# EAGLE design programmer (EAGLE 7.6.0)
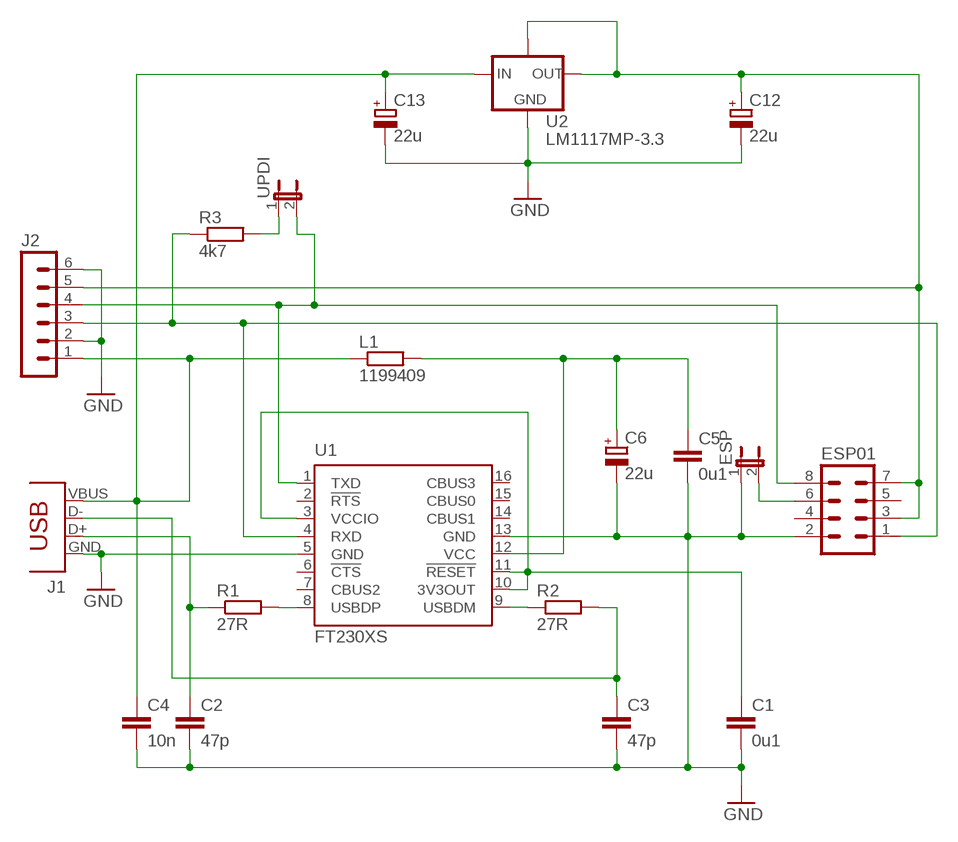
[diagram p0: schematic, sheet 1]

## Parts
C1  0u1  C-EUC0805  [C0805]
C2  47p  C-EUC0805  [C0805]
C3  47p  C-EUC0805  [C0805]
C4  10n  C-EUC0805  [C0805]
C5  0u1  C-EUC0805  [C0805]
C6  22u  CPOL-EUE1.8-4  [E1,8-4]
C12  22u  CPOL-EUE1.8-4  [E1,8-4]
C13  22u  CPOL-EUE1.8-4  [E1,8-4]
ESP  JP1E  [JP1]
ESP01  MA04-2  [MA04-2]
J1  USB_A_PLUG  [USB_A_PLUG]
J2  MA06-1  [MA06-1]
L1  1199409  R-EU_M0805  [M0805]
R1  27R  R-EU_M0805  [M0805]
R2  27R  R-EU_M0805  [M0805]
R3  4k7  R-EU_0207/10  [0207/10]
U1  FT230XS  [SSOP16]
U2  LM1117MP-3.3  LM1117  [SOT230P700X180-4N]
UPDI  JP1E  [JP1]

## Nets
+3V3: C12.+ ESP01.3 ESP01.7 J2.5 U2.2(OUT) U2.4(TAB)
GND: C1.2 C2.2 C3.2 C4.2 C5.2 C6.- C12.- C13.- ESP01.2 ESP.1 J1.GND J2.2 J2.6 U1.5(GND) U1.13(GND) U2.1(GND)
N$1: C1.1 U1.3(VCCIO) U1.10(3V3OUT) U1.11(!RESET)
N$2: R1.2 U1.8(USBDP)
N$3: R2.1 U1.9(USBDM)
N$4: C2.1 J1.D+ R1.1
N$5: C3.1 J1.D- R2.2
N$6: C5.1 C6.+ L1.2 U1.12(VCC)
N$7: C4.1 C13.+ J1.VBUS J2.1 L1.1 U2.3(IN)
N$8: R3.2 UPDI.1
N$12: ESP01.6 ESP.2
RXD: ESP01.1 J2.3 R3.1 U1.4(RXD)
TXD: ESP01.8 J2.4 U1.1(TXD) UPDI.2
Unconnected: ESP01.4 ESP01.5 U1.2(!RTS) U1.6(!CTS) U1.7(CBUS2) U1.14(CBUS1) U1.15(CBUS0) U1.16(CBUS3)

## Library data of the parts
C1-C5 = rcl:C-EU: CAPACITOR, European symbol
C6 C12 C13 = rcl:CPOL-EU: POLARIZED CAPACITOR, European symbol
ESP UPDI = jumper:JP1E: JUMPER
ESP01 = con-lstb:MA04-2: PIN HEADER; OC_FARNELL: unknown; OC_NEWARK: unknown
J1 = ensylam:USB_A_PLUG: BERG USB connector; OC_FARNELL: unknown; OC_NEWARK: unknown
J2 = con-lstb:MA06-1: PIN HEADER; OC_FARNELL: unknown; OC_NEWARK: unknown
L1 R1-R3 = rcl:R-EU_: RESISTOR, European symbol
U1 = ftdichip:FT230X: USB to BASIC UART IC Auto generated by make-symbol-device-package-bsdl.ulp Rev. 43 Source: Data sheet <http://www.ftdichip.com/Support/Documents/DataSheets/ICs/DS_FT230X.pdf>
U2 = ensylam:LM1117: VOLTAGE REGULATOR

## Board
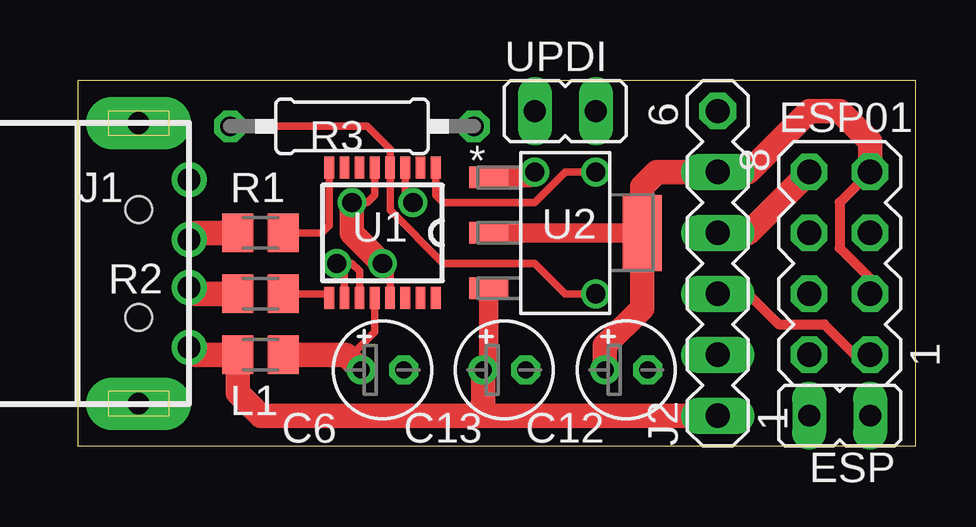
[diagram p1: board, top side]
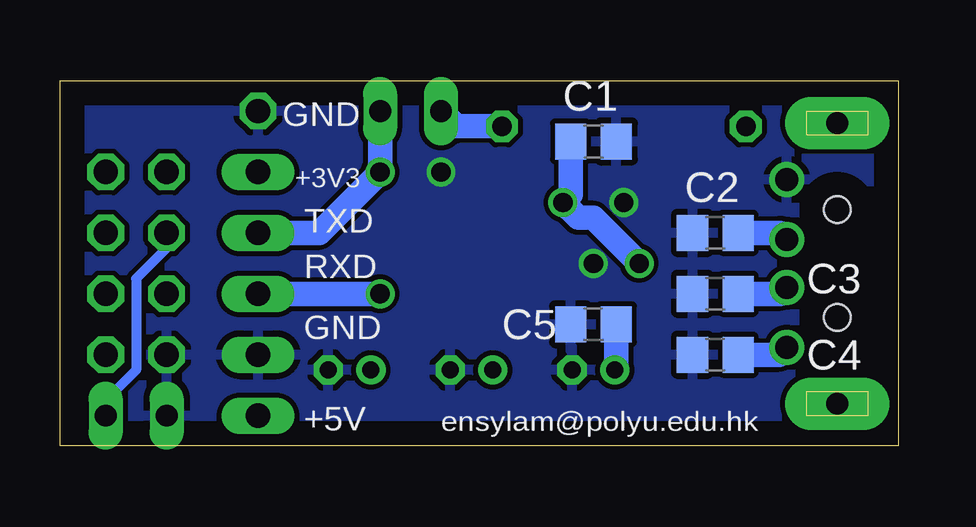
[diagram p2: board, bottom side, seen from below]

Size 34.92 x 15.24 mm. Coordinates in mm from the lower left corner, seen from the top.
Outline: 0,0 34.92,0 34.92,15.24 0,15.24 0,0
Copper layers (1*16): Top 0.035mm / dielectric 1.5mm / Bottom 0.035mm
Design rules "default": minimum track width 10mil, minimum drill 24mil, track to track 8mil, track to pad 8mil, pad to pad 8mil, via to via 8mil, smd to smd 8mil, copper to edge 40mil, drill to drill 8mil, minimum pad ring 10mil, minimum via ring 8mil, stop-mask expansion 4mil, vias tented up to drill 0mil, thermal gap 10mil

### Footprints (pad centres in the part's own frame; a part is rotated, then mirrored left to right if it is on the bottom)
C0805 = smd 1.3 x 1.5: 1 -0.95,0; 2 0.95,0
E1,8-4 = drill 0.711 pad 1.168: + -0.889,0 | drill 0.711 pad 1.168 octagon: - 0.889,0
JP1 = drill 0.914 long: 1 0,-1.27; 2 0,1.27
MA04-2 = drill 1.016 octagon: 1 -3.81,-1.27; 2 -3.81,1.27; 3 -1.27,-1.27; 4 -1.27,1.27; 5 1.27,-1.27; 6 1.27,1.27; 7 3.81,-1.27; 8 3.81,1.27
USB_A_PLUG = drill 0.95: D+ -1,2.1; D- 1,2.1; GND -3.5,2.1; VBUS 3.5,2.1 | drill 0.9 pad 2.184 long: P$1 -5.85,0; P$2 5.85,0 | hole 1.1: -2.25,0; 2.25,0
MA06-1 = drill 1.016 long: 1 -6.35,0; 2 -3.81,0; 3 -1.27,0; 4 1.27,0; 5 3.81,0 | drill 1.016 octagon: 6 6.35,0
M0805 = smd 1.3 x 1.6: 1 -0.95,0; 2 0.95,0
0207/10 = drill 0.813 octagon: 1 -5.08,0; 2 5.08,0
SSOP16 = smd 0.914 x 0.406: 1 -2.718,2.223; 2 -2.718,1.587; 3 -2.718,0.953; 4 -2.718,0.318; 5 -2.718,-0.318; 6 -2.718,-0.953; 7 -2.718,-1.587; 8 -2.718,-2.223; 9 2.718,-2.223; 10 2.718,-1.587; 11 2.718,-0.953; 12 2.718,-0.318; 13 2.718,0.318; 14 2.718,0.953; 15 2.718,1.587; 16 2.718,2.223
SOT230P700X180-4N = smd 1.626 x 0.889: 1 -3.2,2.311; 2 -3.2,0; 3 -3.2,-2.311 | smd 1.626 x 3.175: 4 3.2,0

### Placement (x,y rotation side)
C1  12.7,12.7 0 bottom
C2  7.62,8.89 180 bottom
C3  7.62,6.35 180 bottom
C4  7.62,3.81 180 bottom
C5  12.7,5.08 180 bottom
C6  12.7,3.17 0 top
C12  22.86,3.17 0 top
C13  17.78,3.17 0 top
ESP  31.75,1.27 270 top
ESP01  31.75,7.62 90 top
J1  2.54,7.62 270 top
J2  26.67,7.62 90 top
L1  7.62,3.81 0 top
R1  7.62,8.89 0 top
R2  7.62,6.35 180 top
R3  11.43,13.34 0 top
U1  12.7,8.89 270 top
U2  20.32,8.89 0 top
UPDI  20.32,13.97 270 top

### Tracks (layer width: path | path; a pad name or v marks a point on that pad's centre or on a via)
+3V3
  Top 0.406: ESP01.7 31.75,10.16 31.75,8.26 33.02,6.99 ESP01.3
  Top 0.813: U2.2 U2.4
  Top 1.016: C12.+ 21.97,4.19 23.52,5.74 U2.4 23.52,10.82 24.13,11.43 J2.5 27.94,11.43 30.48,13.97 31.75,13.97 33.02,12.7 ESP01.7
GND  (via drill 0.8)
  Top 0.305: U1.13 13.02,7.3 v12.7,7.62 | U1.5 12.38,10.48 12.06,10.16 v11.43,10.16
  Top 0.813: U2.1 18.82,11.2 v19.05,11.43
  Top 1.016: v12.7,7.62 11.43,8.89 v11.43,10.16
  pour Bottom: 0,15.24 0,0 34.92,0 34.92,15.24
N$1  (via drill 0.8)
  Top 0.305: U1.10 11.11,7.3 v10.79,7.62 11.43,7.62 11.75,7.3 U1.11 | U1.3 13.65,10.48 v13.97,10.16
  Bottom 1.016: v10.79,7.62 12.7,9.53 13.34,9.53 v13.97,10.16 13.65,10.48 C1.1
N$2
  Top 0.305: U1.8 10.48,9.21 10.16,8.89 R1.2
N$3
  Top 0.305: R2.1 10.3,6.35 U1.9
N$4
  Top 1.016: C2.1 4.91,8.89 J1.D+
  Bottom 1.016: C2.1 4.91,8.89 J1.D+
N$5
  Top 1.016: C3.1 4.91,6.35 J1.D-
  Bottom 1.016: C3.1 4.91,6.35 J1.D-
N$6
  Top 0.305: U1.12 12.38,4.76 11.3,3.68
  Top 1.016: L1.2 11.18,3.81 11.3,3.68 C6.+
  Bottom 1.016: C5.1 11.75,3.24 C6.+
N$7
  Top 0.813: U2.3 17.12,3.4 C13.+
  Top 1.016: J1.VBUS 4.95,3.81 L1.1 6.67,2.22 7.62,1.27 16.51,1.27 | 16.51,1.27 J2.1 | C13.+ 16.89,1.65 16.51,1.27
  Bottom 1.016: L1.1 4.95,3.81 J1.VBUS
N$8
  Bottom 1.016: R3.2 18.41,13.34 UPDI.1
N$12
  Bottom 0.406: ESP01.6 30.48,8.26 31.75,6.99 31.75,3.17 33.02,1.91 ESP.2
RXD  (via drill 0.8)
  Top 0.305: v21.59,6.35 20.32,6.35 19.05,7.62 15.24,7.62 13.02,9.84 U1.4 13.02,12.38 12.06,13.34 R3.1
  Top 0.406: J2.3 27.94,6.35 29.21,5.08 31.11,5.08 32.38,3.81 ESP01.1
  Bottom 1.016: J2.3 v21.59,6.35
TXD  (via drill 0.8)
  Top 0.305: U1.1 14.92,10.48 15.24,10.16 19.05,10.16 20.32,11.43 v21.59,11.43
  Top 1.016: ESP01.8 27.94,8.89 J2.4
  Bottom 1.016: UPDI.2 v21.59,11.43 24.13,8.89 J2.4

### Text on the board
bPlace: GND | +3V3 | TXD | RXD | GND | ensylam@polyu.edu.hk | +5V
tDocu: GND / +3V3 / TXD / RXD / GND / +5V